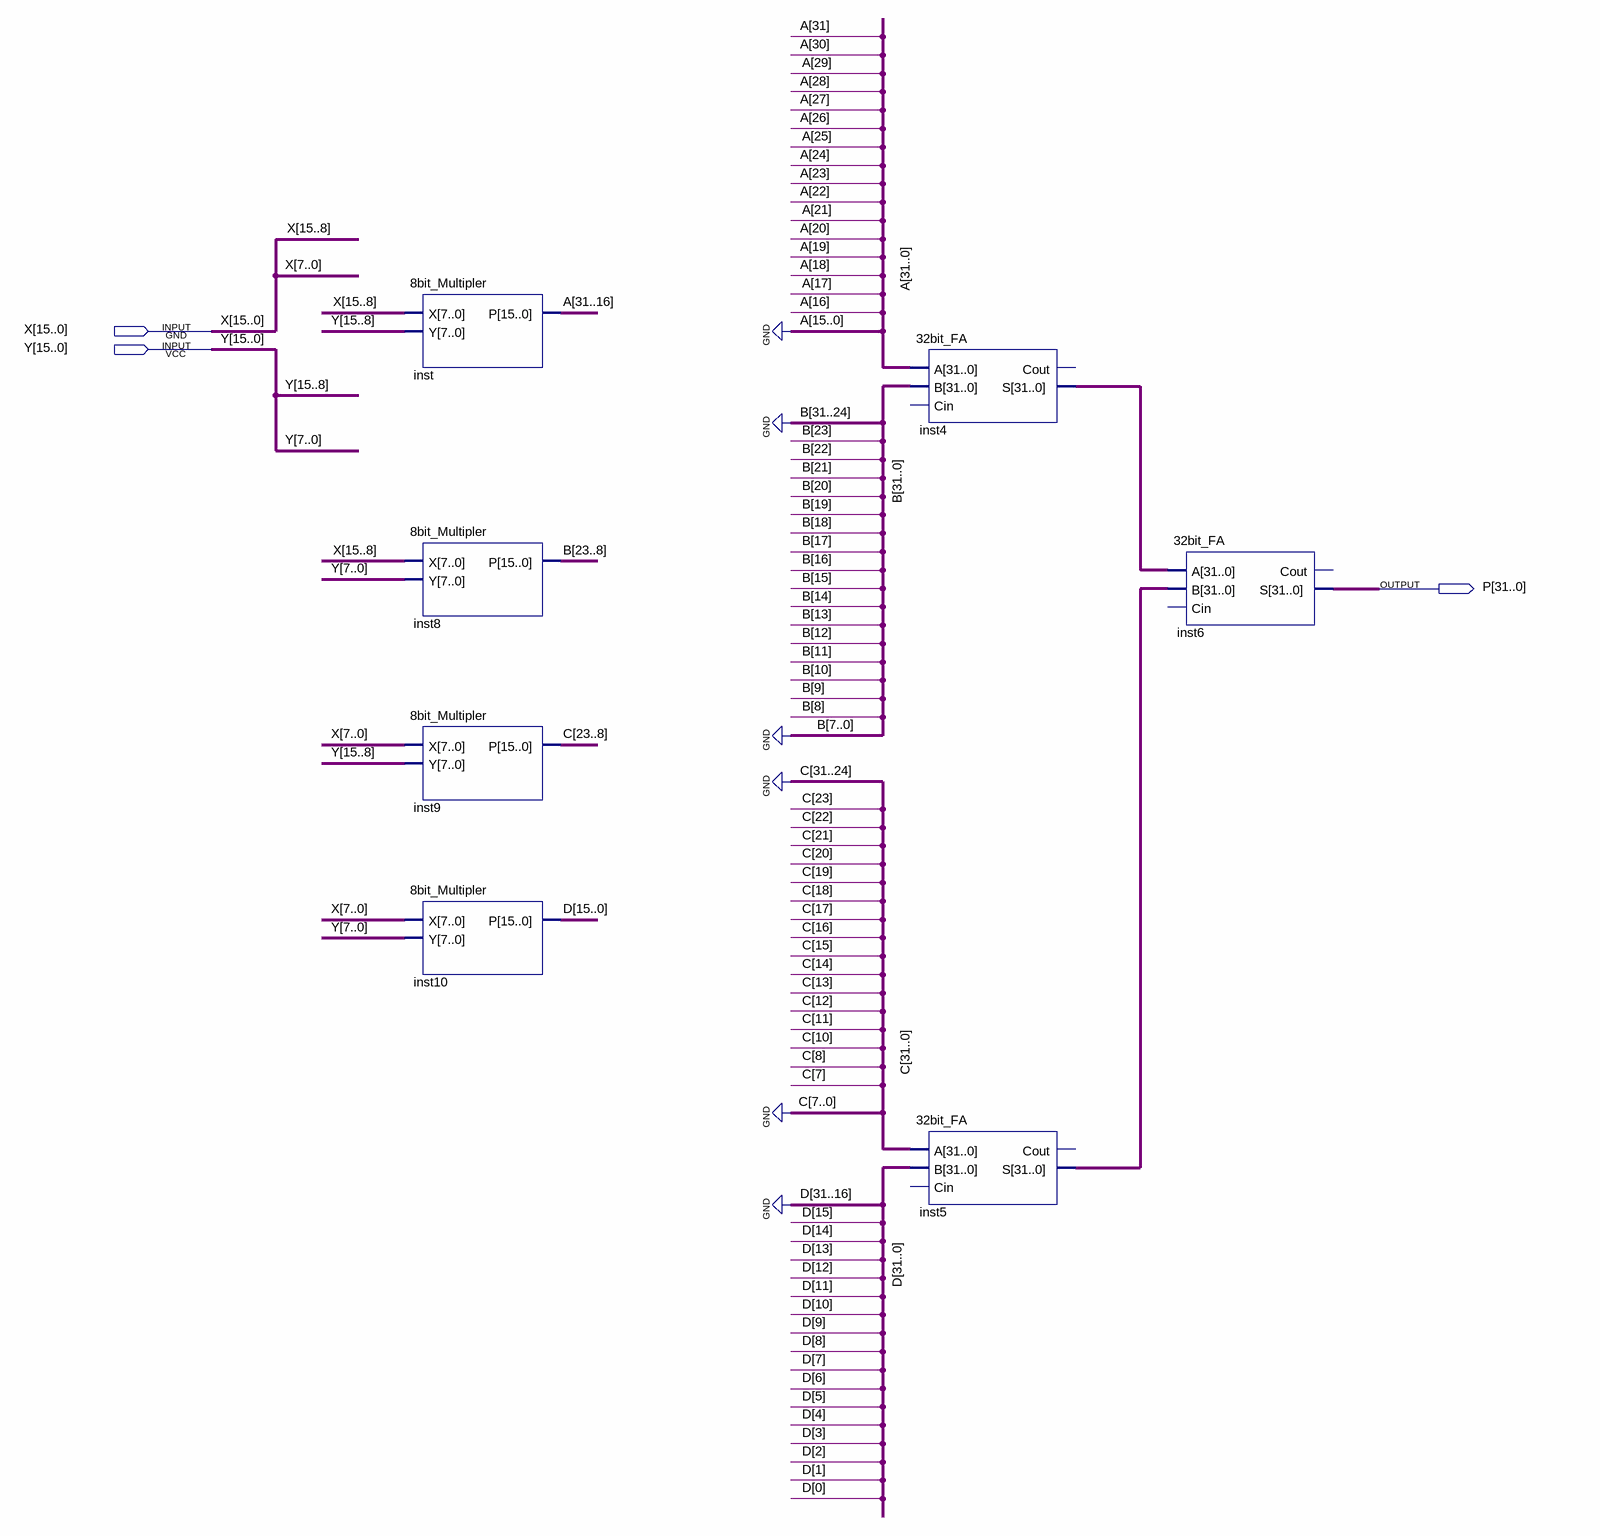
[diagram p0: schematic sheet]
// Quartus schematic 16bit_Multipler.bdf as structural Verilog: 7 symbols, 3 pins
module \16bit_Multipler  (
  input  [15:0] X,
  input  [15:0] Y,
  output [31:0] P
);

  wire [15:0] D;
  wire [23:8] B, C;
  wire [31:0] inst4_s, inst5_s;
  wire [31:16] A;

  \8bit_Multipler  inst (.X(X[15:8]), .Y(Y[15:8]), .P(A));
  \8bit_Multipler  inst8 (.X(X[15:8]), .Y(Y[7:0]), .P(B));
  \8bit_Multipler  inst9 (.X(X[7:0]), .Y(Y[15:8]), .P(C));
  \8bit_Multipler  inst10 (.X(X[7:0]), .Y(Y[7:0]), .P(D));
  \32bit_FA  inst4 (.A({A, {16{1'b0}}}), .B({{8{1'b0}}, B, {8{1'b0}}}), .S(inst4_s));  // open: Cin, Cout
  \32bit_FA  inst5 (.A({{8{1'b0}}, C, {8{1'b0}}}), .B({{16{1'b0}}, D}), .S(inst5_s));  // open: Cin, Cout
  \32bit_FA  inst6 (.A(inst4_s), .B(inst5_s), .S(P));  // open: Cin, Cout
endmodule
